# Altium schematic sheet power.SchDoc
size A
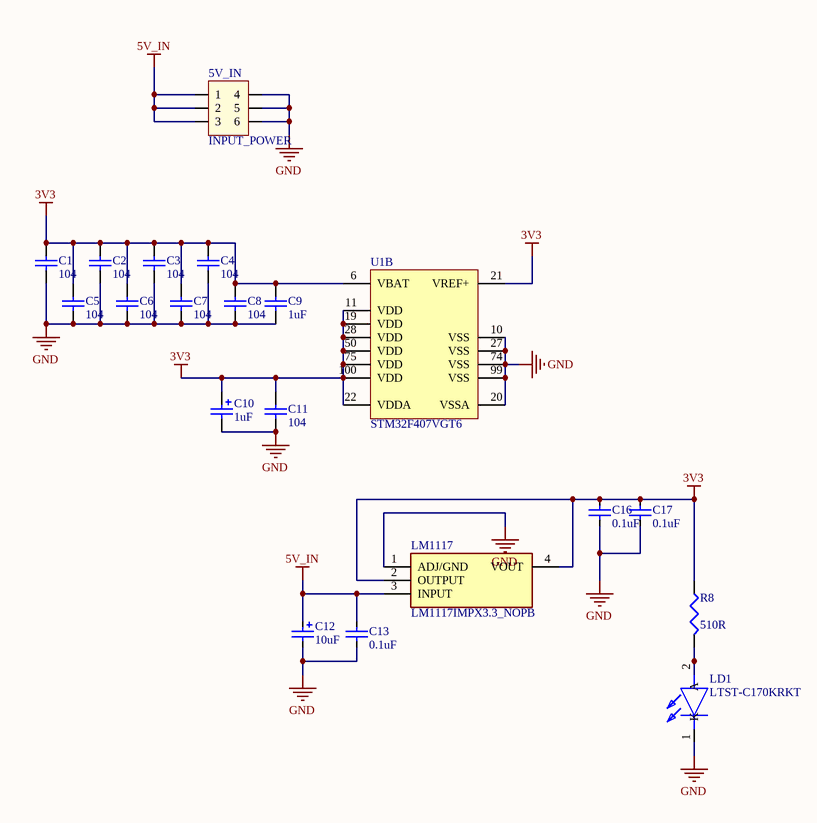
[diagram p0: power.SchDoc]

## Parts
5V_IN  INPUT_POWER  [JP3x2]
C1  104  [CAPC2012X98N]
C2  104  [CAPC2012X98N]
C3  104  [CAPC2012X98N]
C4  104  [CAPC2012X98N]
C5  104  [CAPC2012X98N]
C6  104  [CAPC2012X98N]
C7  104  [CAPC2012X98N]
C8  104  [CAPC2012X98N]
C9  1uF  [CAPC1608X90N]
C10  1uF  [CAPPM3216X180N]
C11  104  [CAPC2012X98N]
C12  10uF  [CAPPM3528X210N]
C13  value 0.1uF  [CAPC3216X135N]  (hidden comment: Cap_0603)
C16  value 0.1uF  [CAPC3216X135N]  (hidden comment: Cap_0603)
C17  value 0.1uF  [CAPC3216X135N]  (hidden comment: Cap_0603)
LD1  LTST-C170KRKT  [LEDC2012X120N]
LM1117  LM1117IMPX3.3_NOPB  [SOT230P700X180-4N]
R8  value 510R  [RESC1608X55N]
U1  STM32F407VGT6  [STM-LQFP100_N]  (part B of 2)

## Nets
3V3: C1.1 C2.1 C3.1 C4.1 C5.1 C6.1 C7.1 C8.1 C9.2 C10.1 C11.1 C16.2 C17.2 LM1117.2(OUTPUT) LM1117.4(VOUT) R8.1 U1.6(VBAT) U1.11(VDD) U1.19(VDD) U1.21(VREF+) U1.22(VDDA) U1.28(VDD) U1.50(VDD) U1.75(VDD) U1.100(VDD)
5V_IN: 5V_IN.1 5V_IN.2 5V_IN.3 C12.1 C13.2 LM1117.3(INPUT)
GND: 5V_IN.4 5V_IN.5 5V_IN.6 C1.2 C2.2 C3.2 C4.2 C5.2 C6.2 C7.2 C8.2 C9.1 C10.2 C11.2 C12.2 C13.1 C16.1 C17.1 LD1.1(K) LM1117.1(ADJ/GND) U1.10(VSS) U1.20(VSSA) U1.27(VSS) U1.74(VSS) U1.99(VSS)
NetLD1_2: LD1.2(A) R8.2

## Library data of the parts
5V_IN = JP3x2: Connector 3x2; Value: Connector 3x2
C1 = Cap Semi: Capacitor (Semiconductor SIM Model); Component Code: C0805X104K5RAC3316; LatestRevisionDate: 17-Jul-2002; LatestRevisionNote: Re-released for DXP Platform.; PackageReference: C1206; Publisher: Altium Limited; Value: 104
C2-C8 C11 = Cap Semi: Capacitor (Semiconductor SIM Model); LatestRevisionDate: 17-Jul-2002; LatestRevisionNote: Re-released for DXP Platform.; PackageReference: C1206; Publisher: Altium Limited; Value: 104
C9 = Cap Semi: Capacitor (Semiconductor SIM Model); Value: 104; Component Code: CC0603KRX5R7BB105; LatestRevisionDate: 17-Jul-2002; LatestRevisionNote: Re-released for DXP Platform.; PackageReference: C1206; Publisher: Altium Limited
C10 = Cap Pol2: Polarized Capacitor (Axial); Published: 8-Jun-2000; LatestRevisionDate: 17-Jul-2002; LatestRevisionNote: Re-released for DXP Platform.; PackageReference: POLAR0.8; Publisher: Altium Limited; PackageDescription: Polarized Capacitor; 2 Leads; Value: 1uF
C12 = Cap_Tan_1210: Tantalum Capacitor; Value: 10uF
C13 C16 C17 = Cap_0603: Capacitor
LD1 = LTST-C171GKT: LED; Manufacturer_Name: Lite-On; Datasheet Link: https://media.digikey.com/pdf/Data%20Sheets/Lite-On%20PDFs/LTST-C171GKT.pdf; Height: 0.9mm; Manufacturer_Part_Number: LTST-C171GKT; Mouser Part Number: 859-LTST-C171GKT; Mouser Price/Stock: https://www.mouser.com/Search/Refine.aspx?Keyword=859-LTST-C171GKT; RS Part Number: 6920935P; RS Price/Stock: http://uk.rs-online.com/web/p/products/6920935P
LM1117 = LM1117IMPX3.3_NOPB: Integrated Circuit; Manufacturer_Name: Texas Instruments; Manufacturer_Part_Number: LM1117IMPX3.3/NOPB; Datasheet Link: http://www.ti.com/lit/ds/symlink/lm1117.pdf; Height: 1.8mm
R8 = Res3: Resistor; Published: 8-Jun-2000; LatestRevisionDate: 29-May-2009; LatestRevisionNote: IPC-7351 Footprint Added.; PackageReference: J1-0603; Publisher: Altium Limited; PackageDescription: Chip Resistor
U1 = STM32F407VGT6: ARM Cortex-M4 32-bit MCU+FPU, 210 DMIPS, 1024 kB Flash, 192 kB Internal RAM, 82 I/Os, 100-pin LQFP, -40 to 85 degC, Tray; Manufacturer: STMicroelectronics; D/A Converter: 2x12-bit; FLASH Size (Prog) (kB): 1024; I/Os (High Current): 82; Internal RAM Size (kB): 192; Operating Frequency(F) (Processor speed) (MHz): 168; Supply Voltage(Vcc) max (V): 3.6; Supply Voltage(Vcc) min (V): 1.8; DatasheetVersion: Rev. 4; PackageVersion: Rev. 1, 06/2013; PackageReference: LQFP100; PackageDescription: 100-Pin Low Profile Quad Flat Package, 14 x 14 mm Body, 0.5 mm Pitch; Supplier 1: Digi-Key; Supplier Part Number 1: 497-11605-ND; Supplier 2: Farnell; Supplier Part Number 2: 2064368; Supplier 3: Newark; Supplier Part Number 3: 73T2333; Supplier 4: Mouser; Supplier Part Number 4: 511-STM32F407VGT6; Core: ARM Cortex-M4; Packing: Tray; Mounting Technology: Surface Mount; PartNumber: STM32F407VGT6; ComponentLink1Description: Manufacturer URL; ComponentLink1URL: http://www.st.com/web/en/home.html; ComponentLink2Description: Datasheet; ComponentLink2URL: http://www.st.com/st-web-ui/static/active/en/resource/technical/document/datasheet/DM00037051.pdf; ComponentLink3Description: Package Specification; ComponentLink3URL: http://www.st.com/st-web-ui/static/active/en/resource/technical/document/data_brief/DM00071938.pdf